# EAGLE design Papra TH_eagle (EAGLE 9.6.2)
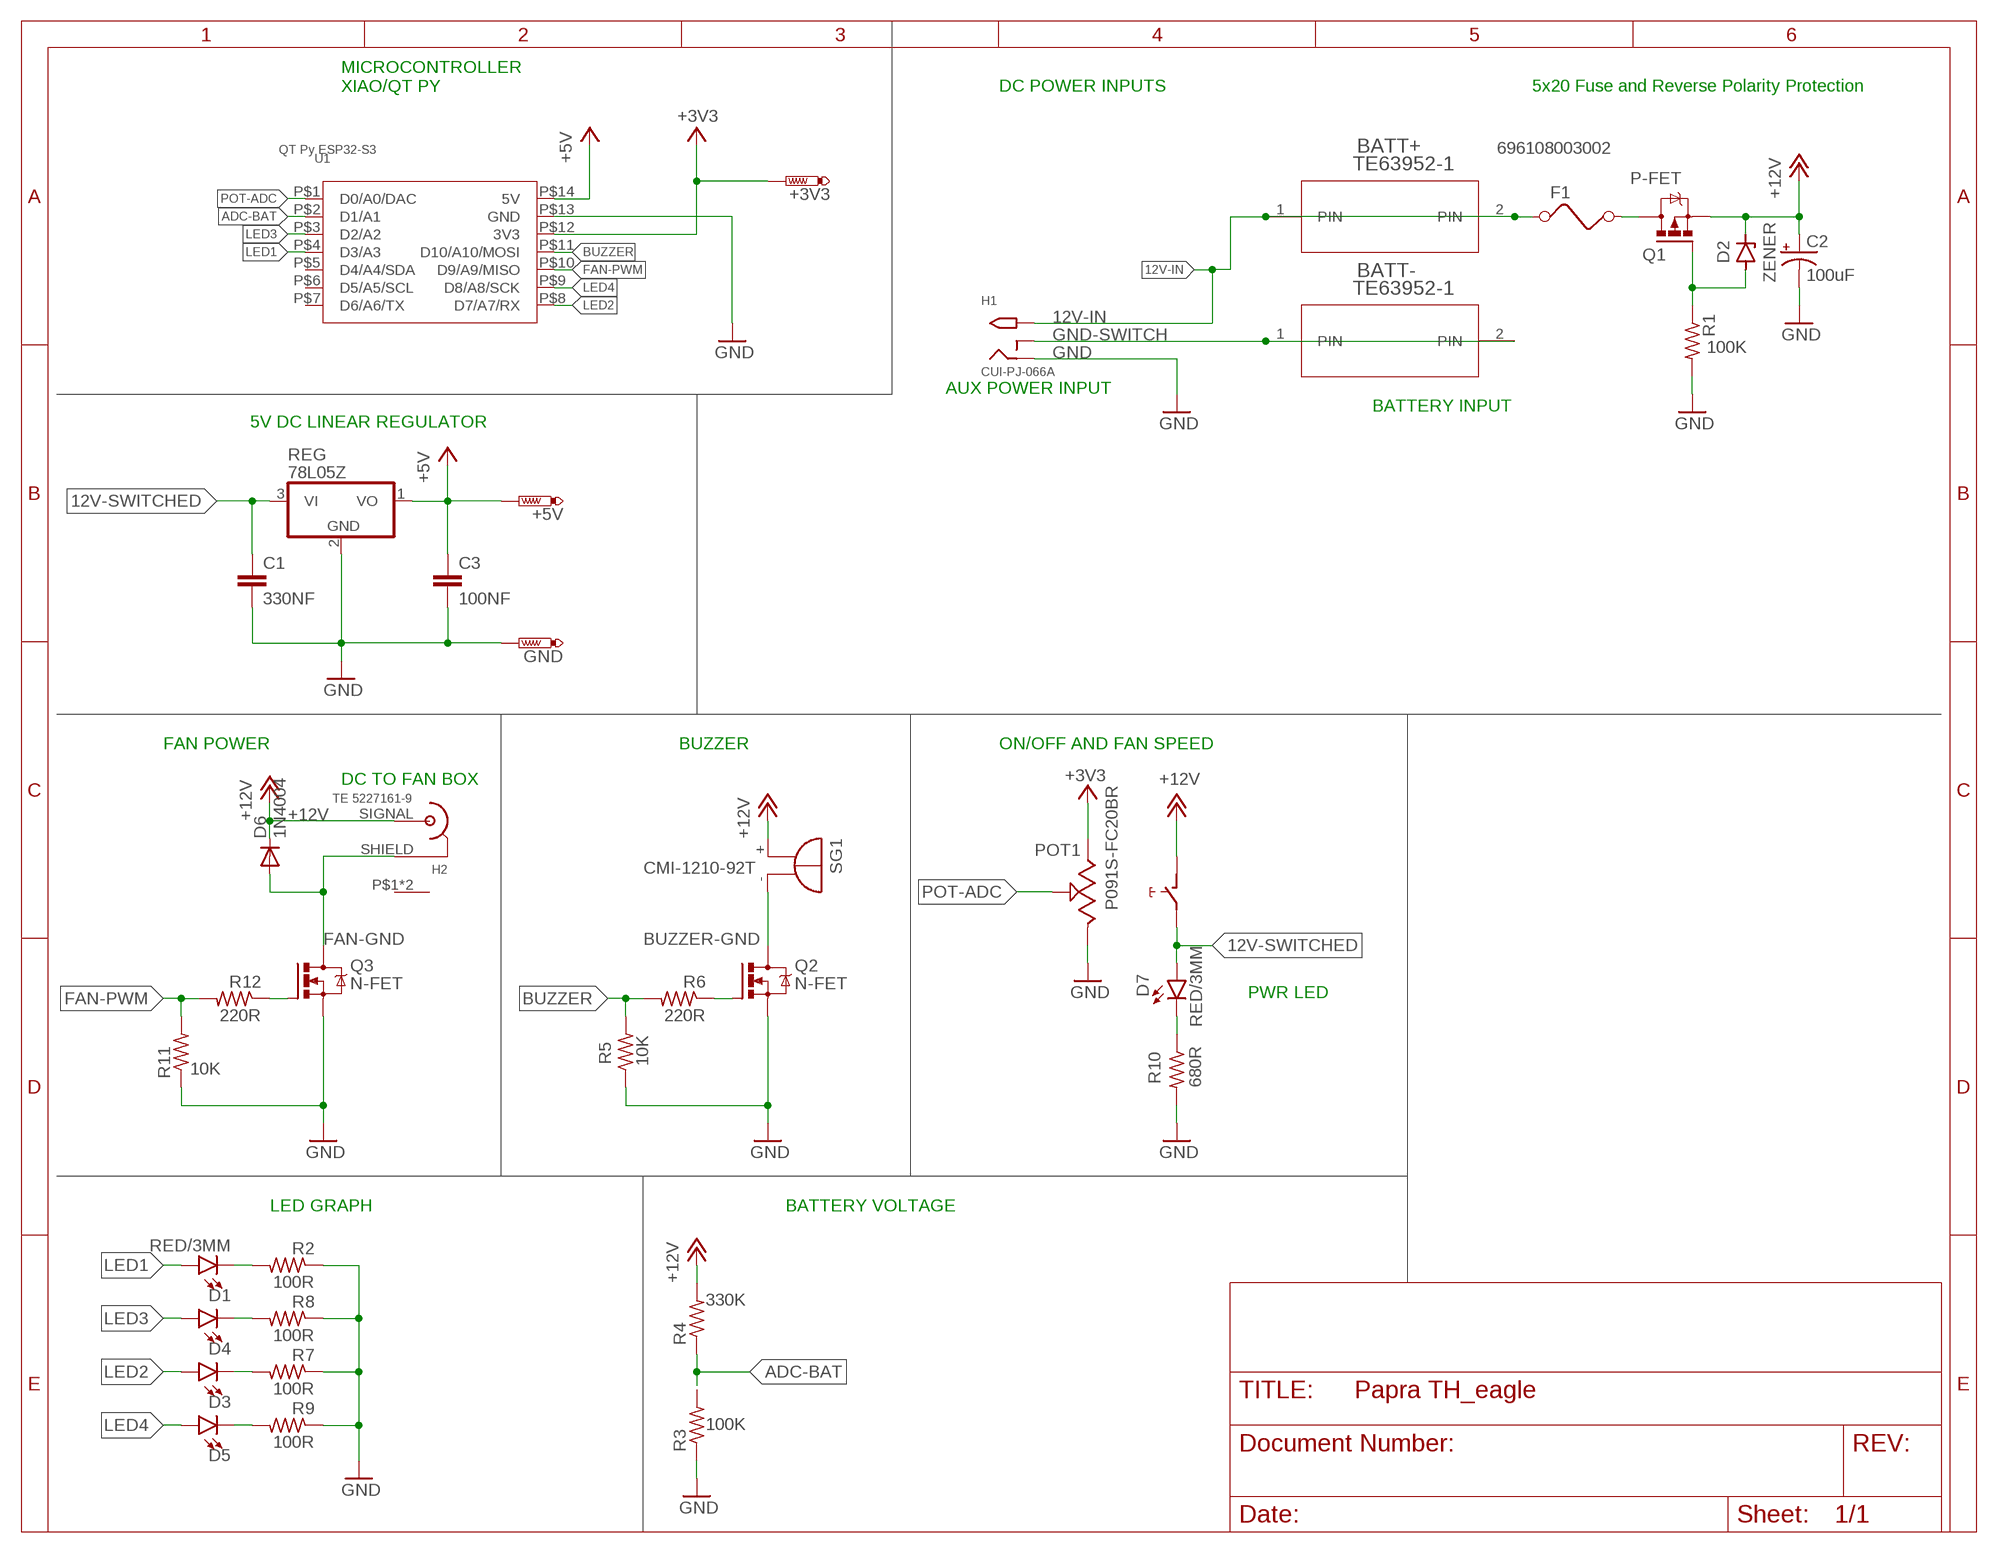
[diagram p0: schematic, sheet 1]

## Parts
+3V3  PTR1PAD1-17  [P1-17]
+5V  PTR1PAD1-17  [P1-17]
BATT+  TE63952-1  [TE63952-1]
BATT-  TE63952-1  [TE63952-1]
C1  330NF  0.1UF-KIT-EZ-50V-20%  [CAP-PTH-SMALL-KIT]
C2  100uF  100UF-POLAR-RADIAL-2.5MM-25V-20%  [CPOL-RADIAL-2.5MM-6.5MM]
C3  100NF  0.1UF-KIT-EZ-50V-20%  [CAP-PTH-SMALL-KIT]
D1  RED/3MM  LED3MM  [LED_3MM]
D2  ZENER  ZENER_DIODE-AXIAL  [DIODE-AXIAL]
D3  RED/3MM  LED3MM  [LED_3MM]
D4  RED/3MM  LED3MM  [LED_3MM]
D5  RED/3MM  LED3MM  [LED_3MM]
D6  1N4004  [DO41-10]
D7  RED/3MM  LED3MM  [LED_3MM]
F1  696108003002  FUSE  [FUSE]
GND  PTR1PAD1-17  [P1-17]
H1  CUI-PJ-066A  CUI-PJ-066ASLOTTED  [DCJACK-PJ-066A-SLOT]
H2  TE 5227161-9  TE-BNC  [TE-BNC]
POT1  P091S-FC20BR  [P091S-FC20BR]
Q1  P-FET  PMOSFET__TO220  [TO220BV]
Q2  N-FET  NMOSFET_TO220  [TO220BV]
Q3  N-FET  NMOSFET_TO220  [TO220BV]
R1  100K  R-US_0207/10  [0207/10]
R2  100R  R-US_0207/10  [0207/10]
R3  100K  R-US_0207/10  [0207/10]
R4  330K  R-US_0207/10  [0207/10]
R5  10K  R-US_0207/10  [0207/10]
R6  220R  R-US_0207/10  [0207/10]
R7  100R  R-US_0207/10  [0207/10]
R8  100R  R-US_0207/10  [0207/10]
R9  100R  R-US_0207/10  [0207/10]
R10  680R  R-US_0207/10  [0207/10]
R11  10K  R-US_0207/10  [0207/10]
R12  220R  R-US_0207/10  [0207/10]
REG  78L05Z  [TO92]
SG1  CMI-1210-92T  F/TMB  [F/TMB]
U1  QT Py ESP32-S3  MOUDLE-SEEEDUINO-XIAOTHRUHOLE+CASTELLATION  [MODULE14P-TH+PAD]

## Nets
12V-IN [RAIL]: BATT+.1(PIN) BATT+.2(PIN) F1.1 H1.PWR$1(TIP) H1.PWR$2(TIP) H1.PWR$3(TIP) H1.PWR(TIP)
12V-IN-FUSED: F1.2 Q1.D
12V-IN-GATE: D2.1(A) Q1.G R1.1
12V-SWITCHED: C1.1 D7.A POT1.NO REG.3(VI)
+3V3: +3V3.TP POT1.3 U1.P$12(3V3)
+5V [RAIL]: +5V.TP C3.1 REG.1(VO) U1.P$14(5V)
+12V [RAIL]: C2.1(+) D2.2(C) D6.C H2.SIGNAL(P1) POT1.COM Q1.S R4.2 SG1.+
ADC-BAT: R3.2 R4.1 U1.P$2(D1/A1)
BUZZER: R5.2 R6.2 U1.P$11(D10/A10/MOSI)
BUZZER-GND [RAIL]: Q2.D SG1.-
FAN-GND [RAIL]: D6.A H2.SHIELD(P2) Q3.D
FAN-PWM: R11.2 R12.2 U1.P$10(D9/A9/MISO)
FETGATE: Q3.G R12.1
FETGATE1: Q2.G R6.1
GND: C1.2 C2.2(-) C3.2 GND.TP H1.GND$1(RING) H1.GND$2(RING) H1.GND$3(RING) H1.GND(RING) POT1.1 Q2.S Q3.S R1.2 R2.1 R3.1 R5.1 R7.1 R8.1 R9.1 R10.2 R11.1 REG.2(GND) U1.P$13(GND)
GND-SWITCH: BATT-.1(PIN) BATT-.2(PIN) H1.GNDBREAK$1(RING_SW) H1.GNDBREAK$2(RING_SW) H1.GNDBREAK$3(RING_SW) H1.GNDBREAK(RING_SW)
LED1: D1.A U1.P$4(D3/A3)
LED1.R: D1.K(C) R2.2
LED2: D3.A U1.P$8(D7/A7/RX)
LED2.R: D4.K(C) R8.2
LED3: D4.A U1.P$3(D2/A2)
LED3.R: D3.K(C) R7.2
LED4: D5.A U1.P$9(D8/A8/SCK)
LED4.R: D5.K(C) R9.2
LED5-R: D7.K(C) R10.1
POT-ADC: POT1.2 U1.P$1(D0/A0/DAC)
Unconnected: H2.P$1(P3) H2.P$2(P3) U1.P$5(D4/A4/SDA) U1.P$6(D5/A5/SCL) U1.P$7(D6/A6/TX)

## Notes on the sheet
- MICROCONTROLLER
  XIAO/QT PY
- DC POWER INPUTS | 5x20 Fuse and Reverse Polarity Protection
- AUX POWER INPUT
- BATTERY INPUT
- 5V DC LINEAR REGULATOR
- FAN POWER | BUZZER | ON/OFF AND FAN SPEED
- DC TO FAN BOX
- PWR LED
- LED GRAPH | BATTERY VOLTAGE

## Library data of the parts
+3V3 +5V GND = testpad:PTR1: TEST PIN
BATT+ BATT- = PC-LIB:TE63952-1
C1 C3 = SparkFun-Capacitors:0.1UF: 0.1µF ceramic capacitors A capacitor is a passive two-terminal electrical component used to store electrical energy temporarily in an electric field.; PROD_ID: CAP-08370; VALUE: 0.1uF
C2 = SparkFun-Capacitors:100UF-POLAR: 100µF polarized capacitors A capacitor is a passive two-terminal electrical component used to store electrical energy temporarily in an electric field.; PROD_ID: CAP-08439
D1 D3-D5 D7 = SparkFun-LED:LED: LED (Generic) Standard schematic elements and footprints for 5mm, 3mm, 1206, and 0603 sized LEDs. Generic LEDs with no color specified.; PROD_ID: DIO-08794
D2 = Tinkercad:ZENER: Zener Diode - Generic
D6 = adafruit:1N4004: DIODE General purpose 1N400x type rectifier (With bigger pads) http://www.ladyada.net/library/pcb/eaglelibrary.html
F1 = special:FUSE: FUSE 5 x 20 mm
H1 = PC-LIB:CUI-PJ-066A: Slotted
H2 = PC-LIB:TE-BNC: https://www.te.com/usa-en/product-1-1478032-0.html
POT1 = PC-LIB:P091S-FC20BR: TT P091S-FC20BR10K
Q1 = Tinkercad:PMOSFET: P-Channel MOSFET - Generic; CATEGORY: Transistor; SUB-CATEGORY: MOSFET; TYPE: P-Channel; VALUE: PMOSFET
Q2 Q3 = Transistor:NMOSFET: N-Channel MOSFET - Generic; CATEGORY: Transistor; SUB-CATEGORY: MOSFET; TYPE: N-Channel; VALUE: NMOSFET
R1-R12 = rcl:R-US_: RESISTOR, American symbol; SPICEPREFIX: R
REG = adafruit:78*: Positive VOLTAGE REGULATOR Added bigger pads to the TO-92 package
SG1 = buzzer:F/TMB: BUZZER Source: Buerklin; OC_FARNELL: unknown; OC_NEWARK: unknown
U1 = Seeeduino-XIAO-footprint-eagle:MOUDLE-SEEEDUINO-XIAO

## Net classes
0 default: width 0.152 mm
1 RAIL: width 0.229 mm

## Board
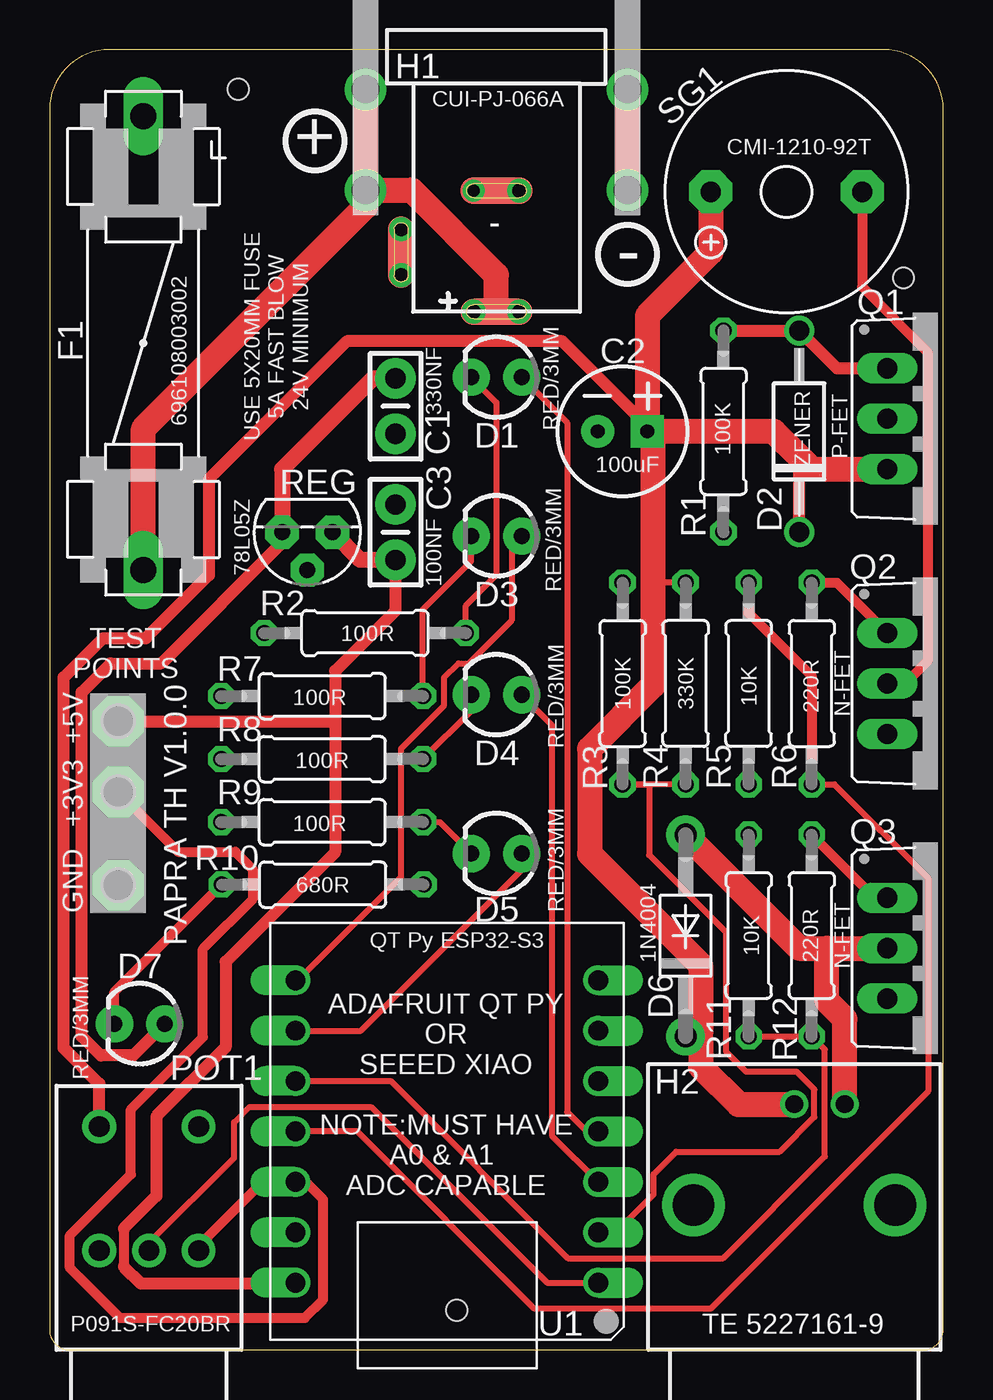
[diagram p1: board, top side]
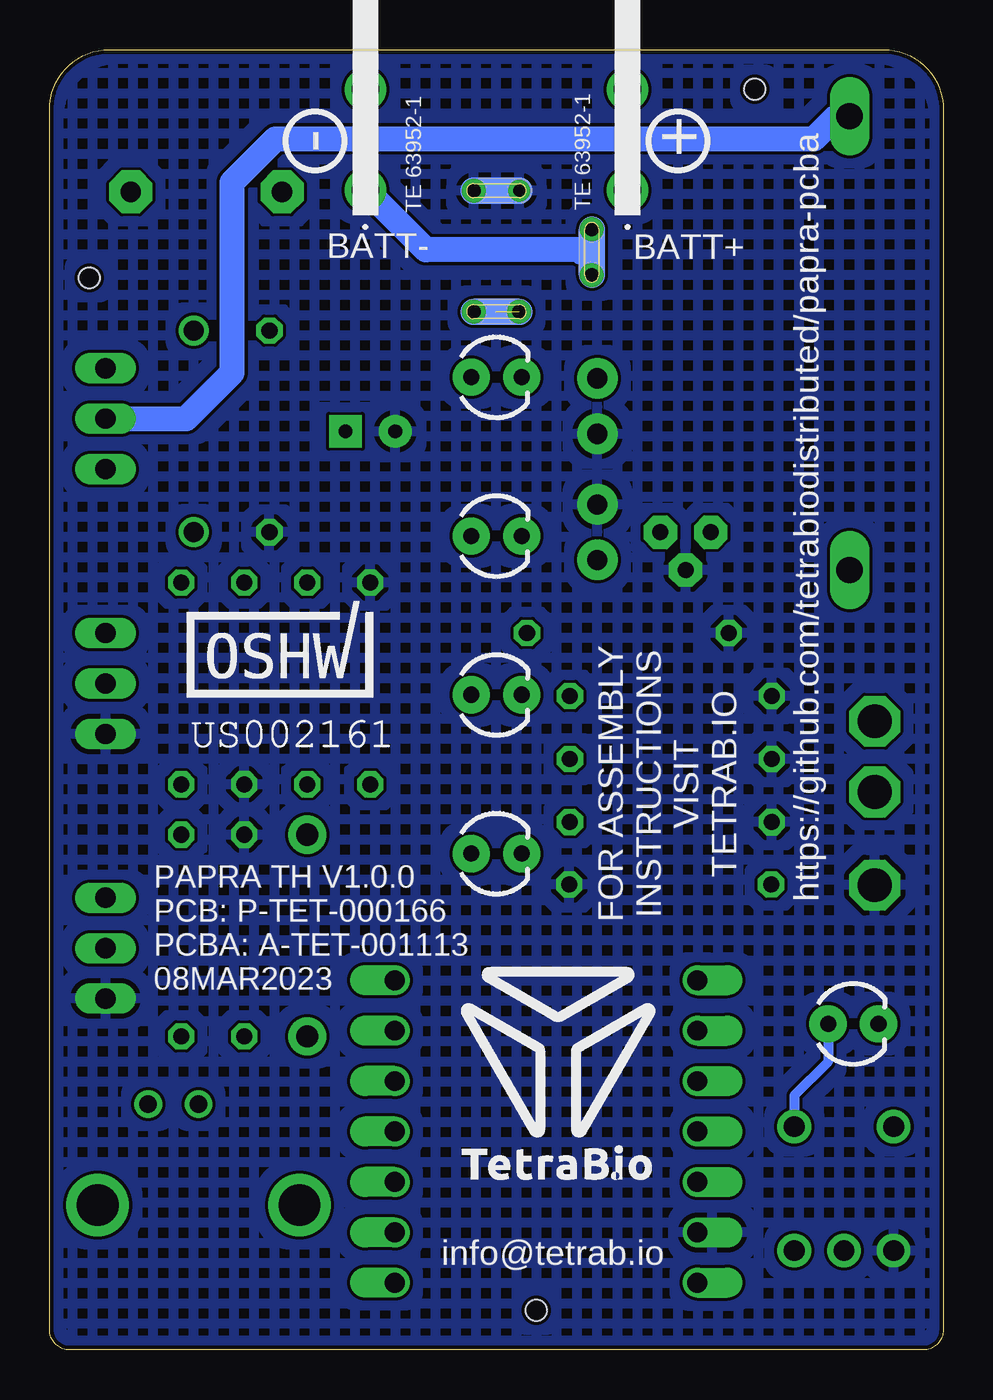
[diagram p2: board, bottom side, seen from below]

Size 45 x 65.5 mm. Coordinates in mm from the lower left corner, seen from the top.
Outline: 1,0 44,0 arc90 45,1 45,62.5 arc90 42,65.5 3,65.5 arc90 0,62.5 0,1 arc90 1,0
Copper layers (1*16): Top 0.035mm / dielectric 1.6mm / Bottom 0.035mm
Design rules "jlcpcb-2layers": minimum track width 5mil, minimum drill 0.3mm, track to track 5mil, track to pad 5mil, pad to pad 5mil, via to via 5mil, smd to smd 5mil, copper to edge 0.2mm, drill to drill 6mil, minimum pad ring 10mil, minimum via ring 3mil, stop-mask expansion 4mil, vias tented up to drill 0mil, thermal gap 10mil
Holes 1.05 mm at 20.5,2 9.5,63.5 43,54

### Footprints (pad centres in the part's own frame; a part is rotated, then mirrored left to right if it is on the bottom)
P1-17 = drill 1.702 pad 2.54 octagon: TP 0,0
TE63952-1 = drill 1.397 pad 1.905: 1 -2.54,0; 2 2.54,0
CAP-PTH-SMALL-KIT = drill 1.016 pad 2.032: 1 -1.397,0; 2 1.397,0
CPOL-RADIAL-2.5MM-6.5MM = drill 0.7 pad 1.651 square: 1 1.25,0 | drill 0.7 pad 1.651: 2 -1.25,0
LED_3MM = drill 0.813 pad 1.88: A -1.27,0; K 1.27,0
DIODE-AXIAL = drill 1: 1 -5.08,0; 2 5.08,0
DO41-10 = drill 1.118 pad 1.93: A 5.08,0; C -5.08,0
FUSE = drill 1.321 long: 1 -11.43,0; 2 11.43,0
DCJACK-PJ-066A-SLOT = smd 3.6 x 1.3: GND 0,8.1; PWR 0,14.2 | smd 3.6 x 1.3 bottom: GND$1 0,8.1; PWR$1 0,14.2 | drill 0.7: GND$2 -1.15,8.1; GNDBREAK$2 4.8,10.05; GNDBREAK$3 4.8,12.35; PWR$2 -1.15,14.2; PWR$3 1.15,14.2 | drill 0.6: GND$3 1.15,8.1 | smd 1.3 x 3.6: GNDBREAK 4.8,11.2 | smd 1.3 x 3.6 bottom: GNDBREAK$1 4.8,11.2
TE-BNC = drill 2.1: P$1 -7.3,5.08; P$2 -7.3,-5.08 | drill 0.89: SHIELD -12.38,2.54; SIGNAL -12.38,0
P091S-FC20BR = drill 1.05 pad 1.7: 1 -5,-2.5; 2 -5,0; 3 -5,2.5; COM -11.25,-2.5; NO -11.25,2.5
TO220BV = drill 1.016 long: D 0,-2.54; G -2.54,-2.54; S 2.54,-2.54
0207/10 = drill 0.813 octagon: 1 -5.08,0; 2 5.08,0
TO92 = drill 0.813 pad 1.676 octagon: 1 -1.27,0; 2 0,1.905; 3 1.27,0
F/TMB = drill 1.016 pad 2.159 octagon: + 3.81,0; - -3.81,0
MODULE14P-TH+PAD = drill 1 offset: P$1 -7.62,7.62; P$2 -7.62,5.08; P$3 -7.62,2.54; P$4 -7.62,0; P$5 -7.62,-2.54; P$6 -7.62,-5.08; P$7 -7.62,-7.62; P$8 7.62,-7.62; P$9 7.62,-5.08; P$10 7.62,-2.54; P$11 7.62,0; P$12 7.62,2.54; P$13 7.62,5.08; P$14 7.62,7.62

### Placement (x,y rotation side)
+3V3  3.45,28.11 0 top
+5V  3.45,31.66 0 top
BATT+  15.9,60.96 90 bottom
BATT-  29.1,60.96 90 bottom
C1  17.42,47.54 270 top
C2  28.85,46.27 0 top
C3  17.42,41.19 90 top
D1  22.5,49 180 top
D2  37.74,46.27 270 top
D3  22.5,41 180 top
D4  22.5,33 180 top
D5  22.5,25 180 top
D6  32.02,20.87 90 top
D7  4.53,16.43 180 top
F1  4.72,50.72 90 top
GND  3.45,23.41 0 top
H1  22.5,66.5 180 top
H2  37.5,0 270 top
POT1  5,0 270 top
Q1  44.73,46.91 270 top
Q2  44.73,33.57 270 top
Q3  44.73,20.23 270 top
R1  33.93,46.27 270 top
R2  15.88,36.11 0 top
R3  28.85,33.57 270 top
R4  32.02,33.57 90 top
R5  35.2,33.57 90 top
R6  38.38,33.57 270 top
R7  13.72,32.94 0 top
R8  13.72,29.76 0 top
R9  13.72,26.59 0 top
R10  13.75,23.44 0 top
R11  35.2,20.87 270 top
R12  38.38,20.87 270 top
REG  12.97,41.19 180 top
SG1  37.11,58.34 180 top
U1  20,11 180 top

### Tracks (layer width: path | path; a pad name or v marks a point on that pad's centre or on a via)
12V-IN  (1 unrouted)
  Top 1.27: BATT+.1 BATT+.2 | BATT+.1 18.22,58.42 22.5,54.14 H1.PWR H1.PWR$2 | F1.1 4.72,46.4 15.9,57.58 BATT+.1
  Bottom 1.27: H1.PWR H1.PWR$2
12V-IN-FUSED
  Bottom 1.27: Q1.D 38.12,46.91 35.81,49.22 35.81,58.81 33.62,61 6.5,61 5.36,62.14 F1.2
12V-IN-GATE
  Top 0.61: R1.1 D2.1 39.64,49.45 Q1.G
12V-SWITCHED
  Top 0.508: D7.A
  Top 0.61: D7.A 4.2,14.82 2.57,14.82 1.61,15.79 1.61,33.13 3.07,34.59 5.61,34.59 11.71,40.68 REG.3
  Top 0.813: C1.1 16.28,48.94 11.71,44.37 REG.3
  Bottom 0.508: D7.A 5.8,14.52 7.5,12.82 POT1.NO
+3V3
  Top 0.508: POT1.3 7.5,5.23 10.72,8.46 U1.P$12 12.89,8.46 13.77,7.58 13.77,2.53 12.85,1.61 3.53,1.61 1.02,4.13 1.02,5.76 4.09,8.83 4.09,12.12 7.71,15.75 7.71,20.19 10.22,22.7 10.22,24.21 9.35,25.09 6.47,25.09 +3V3.TP
+5V
  Top 0.508: 3.74,6.11 3.74,4.19 | 12.34,3.34 U1.P$14 | 14.23,31.66 14.37,31.66
  Top 0.61: C3.1 17.42,37.25 14.37,34.2 14.37,31.66 14.37,25.06 8.86,19.55 8.86,15.24 5.38,11.76 5.38,7.75 3.74,6.11 | 3.74,4.19 4.59,3.34 12.34,3.34 | +5V.TP 14.23,31.66
  Top 0.813: C3.1 15.64,39.79 REG.1
+12V
  Top 0.305: R4.2 30.37,38.65
  Top 0.508: C2.1 30.1,46.53
  Top 0.61: D2.2 37.74,45 | POT1.COM 2.5,13.41 0.71,15.2 0.71,33.88 2.69,35.86 4.85,35.86 8.02,39.03 8.02,43.86 14.97,50.8 25.82,50.8 30.1,46.53
  Top 1.27: SG1.+ 33.3,55.29 30.1,52.09 C2.1 | C2.1 30.37,46 30.37,38.65 30.37,33.46 27.19,30.28 27.19,24.99 32.78,19.4 32.78,15.91 32.66,15.79 | C2.1 36.47,46.27 37.74,45 38.38,44.37 Q1.S | 32.66,15.79 32.79,15.66 32.79,14.27 34.69,12.36 37.48,12.36 H2.SIGNAL | D6.C 32.66,15.79
ADC-BAT
  Top 0.305: R4.1 R3.2 30.19,28.49 30.19,24.93 34.06,21.06 34.06,15.03 35.07,14.01 37.61,14.01 38.5,13.12 38.5,11.73 36.76,9.98 31.55,9.98 30.41,8.84 30.41,7.83 28.89,6.3 28,6.3 U1.P$2
BUZZER
  Top 0.305: R6.2 39.52,28.49 44.24,23.77 44.24,13.02 33.3,2.07 24.41,2.07 15.48,11 U1.P$11
  Top 0.508: R5.2 35.2,37.13 38.38,33.95 R6.2
BUZZER-GND
  Top 0.508: Q2.D 43.07,33.57 44.22,34.71 44.22,50.25 40.91,53.55 SG1.-
FAN-GND
  Top 1.27: H2.SHIELD 40.04,16.66 39.14,17.57 39.14,20.23 Q3.D 37.74,20.23 D6.A
FAN-PWM
  Top 0.305: R11.2 R12.2 39.03,15.13 39.03,9.74 33.91,4.61 26.1,4.61 17.17,13.54 U1.P$10
FETGATE
  Top 0.508: R12.1 41.55,22.77 Q3.G
FETGATE1
  Top 0.508: Q2.G 39.64,38.65 R6.1
GND
  Top 0.813: H1.GND H1.GND$2
  Bottom 1.27: H1.GND H1.GND$2
  pour Bottom (isolate 0.152, rank 3, hatched): 47.52,72.81 -2.39,72.81 -2.39,-2.11 47.52,-2.11
GND-SWITCH
  Top 1.27: BATT-.2 BATT-.1
  Bottom 1.27: BATT-.1 29.06,58.42 26.06,55.41 18.33,55.41 18.21,55.3 H1.GNDBREAK$1 H1.GNDBREAK$2
LED1
  Top 0.305: D1.A 26.06,46.71 26.06,11.98 27.04,11 U1.P$4
LED1.R
  Top 0.305: D1.K 22.5,47.73 22.5,39.03 20.96,37.49 R2.2
LED2
  Top 0.305: U1.P$8 12.49,18.62 17.7,23.82 17.7,30.29 19.87,32.46 19.87,33.86 20.59,34.59 21.1,34.59 23.26,36.74 23.26,40.49 D3.A
LED2.R
  Top 0.305: D4.K 21.23,32.19 R8.2
LED3
  Top 0.305: D4.A 25.29,31.48 25.29,10.79 U1.P$3
LED3.R
  Top 0.305: R7.2 18.8,37.3 21.23,39.73 D3.K
LED4
  Top 0.305: U1.P$9 15.68,16.08 23.77,24.17 D5.A
LED4.R
  Top 0.305: R9.2 19.64,26.59 D5.K
LED5-R
  Top 0.508: D7.K 3.26,18.03 R10.1
POT-ADC
  Top 0.305: POT1.2 5,5.38 9.29,9.67 9.29,11.47 10.05,12.23 16.19,12.23 25.05,3.38 U1.P$1

### Text on the board
tPlace: USE 5X20MM FUSE / 5A FAST BLOW / 24V MINIMUM | 330NF | 100NF | TEST / POINTS | PAPRA TH V1.0.0 | ADAFRUIT QT PY / OR / SEEED XIAO / / NOTE:MUST HAVE / A0 & A1 / ADC CAPABLE
bPlace: TE 63952-1 | TE 63952-1 | https://github.com/tetrabiodistributed/papra-pcba | FOR ASSEMBLY / INSTRUCTIONS / VISIT / TETRAB.IO | PAPRA TH V1.0.0 / PCB: P-TET-000166 / PCBA: A-TET-001113 / 08MAR2023 | info@tetrab.io
tNames: + | - | - | C1 | C3
bNames: + | -
Document: Changelog / / v0.2 / - BATTERY Tabs swapped (polarity, same position) / - SMT Components Moved, won't affect mechanical / - D1 package changed (was SMB, is SMA) / / v0.3 changelog (see schematic for signal changes) / / - Added mounting hole / - Added fuse, moved SMT components to fit / - Adjustments for JLC DRU, pad override was 40%, reduced to 25% / - Silk cleanup / - Changed Battery Tab package to round pads (was square) / / v0.4 / - Board is 2mm wider on right side / - DC power out is now BNC / / v0.5 / - Added buzzer / / v0.6 / - See schematic changes / / v0.7 / - Board grew 3mm wider / - Buzzer & components adjacent moved to make room for electrolytic / / v0.7.1 / - Added OSHW to bottom silk / / v0.7.2 / - Adding tooling holes for assembly / - Silk tweaks for battery polarity